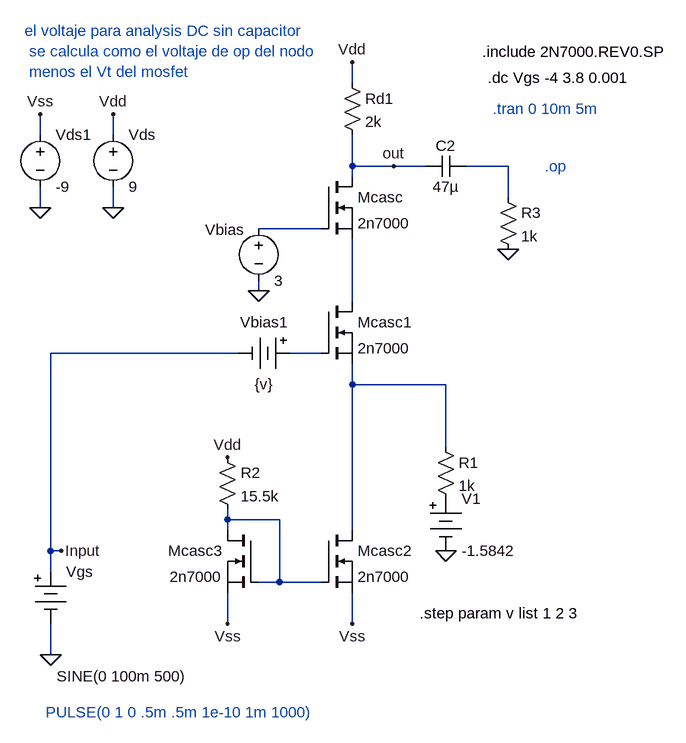
[diagram p0: schematic positive gm 2.asc]
positive gm 2.asc, the LTspice schematic file:
Version 4
SHEET 1 2196 792
WIRE 208 -192 208 -224
WIRE -272 -112 -272 -144
WIRE -160 -112 -160 -144
WIRE 208 -64 208 -112
WIRE 272 -64 208 -64
WIRE 320 -64 272 -64
WIRE 448 -64 384 -64
WIRE 208 -48 208 -64
WIRE 448 -16 448 -64
WIRE -272 0 -272 -32
WIRE -160 0 -160 -32
WIRE 160 32 64 32
WIRE 64 128 64 112
WIRE 208 144 208 48
WIRE 32 224 -256 224
WIRE 160 224 112 224
WIRE 208 272 208 240
WIRE 352 272 208 272
WIRE 352 368 352 272
WIRE 16 480 16 464
WIRE 96 480 16 480
WIRE 16 496 16 480
WIRE 208 496 208 272
WIRE -256 528 -256 224
WIRE -240 528 -256 528
WIRE -256 560 -256 528
WIRE 96 576 96 480
WIRE 96 576 64 576
WIRE 160 576 96 576
WIRE 16 640 16 592
WIRE 208 640 208 592
WIRE -256 688 -256 640
FLAG -256 688 0
FLAG -160 0 0
FLAG -160 -144 Vdd
FLAG 208 -224 Vdd
FLAG 64 128 0
FLAG -240 528 Input
FLAG -272 0 0
FLAG -272 -144 Vss
FLAG 16 384 Vdd
FLAG 16 640 Vss
FLAG 208 640 Vss
FLAG 448 64 0
FLAG 352 528 0
FLAG 272 -64 out
SYMBOL voltage -160 -128 R0
WINDOW 123 0 0 Left 2
WINDOW 39 0 0 Left 2
SYMATTR InstName Vds
SYMATTR Value 9
SYMBOL res 192 -208 R0
SYMATTR InstName Rd1
SYMATTR Value 2k
SYMBOL voltage 64 16 R0
WINDOW 0 -82 18 Left 2
WINDOW 123 0 0 Left 2
WINDOW 39 0 0 Left 2
SYMATTR InstName Vbias
SYMATTR Value 3
SYMBOL battery 128 224 R90
WINDOW 0 -32 56 VBottom 2
WINDOW 3 32 56 VTop 2
SYMATTR InstName Vbias1
SYMATTR Value {v}
SYMBOL nmos 160 144 R0
SYMATTR InstName Mcasc1
SYMATTR Value 2n7000
SYMATTR Prefix X
SYMBOL nmos 160 -48 R0
SYMATTR InstName Mcasc
SYMATTR Value 2n7000
SYMATTR Prefix X
SYMBOL res 336 352 R0
SYMATTR InstName R1
SYMATTR Value 1k
SYMBOL voltage -272 -128 R0
WINDOW 123 0 0 Left 2
WINDOW 39 0 0 Left 2
SYMATTR InstName Vds1
SYMATTR Value -9
SYMBOL nmos 160 496 R0
SYMATTR InstName Mcasc2
SYMATTR Value 2n7000
SYMATTR Prefix X
SYMBOL nmos 64 496 M0
SYMATTR InstName Mcasc3
SYMATTR Value 2n7000
SYMATTR Prefix X
SYMBOL res 0 368 R0
SYMATTR InstName R2
SYMATTR Value 15.5k
SYMBOL cap 384 -80 R90
WINDOW 0 0 32 VBottom 2
WINDOW 3 32 32 VTop 2
SYMATTR InstName C2
SYMATTR Value 47µ
SYMBOL res 432 -32 R0
SYMATTR InstName R3
SYMATTR Value 1k
SYMBOL battery -256 544 R0
WINDOW 3 9 177 Left 2
SYMATTR InstName Vgs
SYMATTR Value SINE(0 100m 500)
SYMBOL battery 352 432 R0
SYMATTR InstName V1
SYMATTR Value -1.5842
TEXT 416 -200 Left 2 !.dc Vgs -4 3.8 0.001
TEXT 408 -240 Left 2 !.include 2N7000.REV0.SP
TEXT 424 -152 Left 2 ;.tran 0 10m 5m
TEXT -264 776 Left 2 ;PULSE(0 1 0 .5m .5m 1e-10 1m 1000)
TEXT 504 -64 Left 2 ;.op
TEXT 312 624 Left 2 !.step param v list 1 2 3
TEXT -296 -272 Left 2 ;el voltaje para analysis DC sin capacitor\n se calcula como el voltaje de op del nodo\n menos el Vt del mosfet

The netlist it stands for:
* positive gm 2.asc
Vds Vdd 0 9
Rd1 Vdd out 2k
Vbias N002 0 3
Vbias1 N004 Input {v}
XMcasc1 N003 N004 N005 2n7000  ; pins D G S
XMcasc out N002 N003 2n7000  ; pins D G S
R1 N005 P001 1k
Vds1 Vss 0 -9
XMcasc2 N005 N006 Vss 2n7000  ; pins D G S
XMcasc3 N006 N006 Vss 2n7000  ; pins D G S
R2 Vdd N006 15.5k
C2 N001 out 47µ
R3 N001 0 1k
Vgs Input 0 SINE(0 100m 500)
V1 P001 0 -1.5842
.dc Vgs -4 3.8 0.001
.include 2N7000.REV0.SP
* .tran 0 10m 5m
* PULSE(0 1 0 .5m .5m 1e-10 1m 1000)
* .op
.step param v list 1 2 3
* el voltaje para analysis DC sin capacitor
*  se calcula como el voltaje de op del nodo
*  menos el Vt del mosfet
.backanno
.end